# Altium schematic sheet Radio.SchDoc
size A
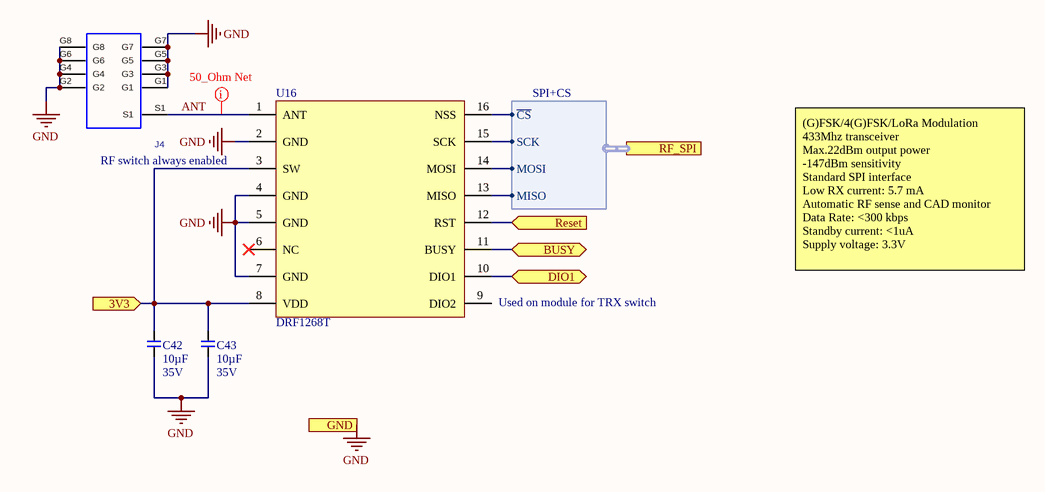
[diagram p0: Radio.SchDoc]

## Parts
C42  Capacitance (shorthand): 10µF  Rated Voltage: 35V  [C0603]  (hidden comment: 490-13248-1-ND)
C43  Capacitance (shorthand): 10µF  Rated Voltage: 35V  [C0603]  (hidden comment: 490-13248-1-ND)
J4  SMA-J-P-X-ST-EM2  [SMA-J-P-X-ST-EM1]  (value not drawn)
U16  DRF1268T  [DRF1268T]

## Ports
3V3 (in), BUSY (bidir), DIO1 (bidir), GND (in), Reset (in), RF_SPI (harness SPI+CS)

## Harnesses
SPI+CS: SCK, MOSI, MISO, ~{CS}

## Nets
GND: C42.2 C43.2 J4.G1 J4.G2 J4.G3 J4.G4 J4.G5 J4.G6 J4.G7 J4.G8 U16.2(GND) U16.4(GND) U16.5(GND) U16.7(GND) ; port GND
3V3: C42.1 C43.1 U16.3(SW) U16.8(VDD) ; port 3V3
ANT: J4.S1 U16.1(ANT)
BUSY: U16.11(BUSY) ; port BUSY
DIO1: U16.10(DIO1) ; port DIO1
Reset: U16.12(RST) ; port Reset
NetU16_13: U16.13(MISO) ; port RF_SPI.MISO
NetU16_14: U16.14(MOSI) ; port RF_SPI.MOSI
NetU16_15: U16.15(SCK) ; port RF_SPI.SCK
NetU16_16: U16.16(NSS) ; port RF_SPI.~{CS}

Not connected (* = marked no-connect by the designer): U16 6(NC)* 9(DIO2)

## Layout directives
rule Clearance Constraint [Generic clearance = 0mil, and 21 value(s) for objects]: ANT

## Notes on the sheet
- RF switch always enabled
- (G)FSK/4(G)FSK/LoRa Modulation
  433Mhz transceiver
  Max.22dBm output power
  -147dBm sensitivity
  Standard SPI interface
  Low RX current: 5.7 mA
  Automatic RF sense and CAD monitor
  Data Rate: <300 kbps
  Standby current: <1uA
  Supply voltage: 3.3V
- (near U16) Used on module for TRX switch

## Library data of the parts
C42 C43 = CMP-119-0071-1: CAP CER 10UF 35V X5R 0603 20%; Manufacturer: Murata Electronics North America; Capacitance - pF (Machine readable): #NAME?; Dielectric: X5R
J4 = CMP-025-0000-1: SMA Samtec, Edge Mount, Long Thread. PCB Footprint designed by timv to improve strength, verifived on several PCBs from BAC.
U16 = CMP-025-0002-1: Dorji DRF1268T LoRa Module with SX1262 IC and TCXO; Design Item ID: RFM_Module